# EAGLE design BRUTUS CONTROL BOARD (EAGLE 6.4)
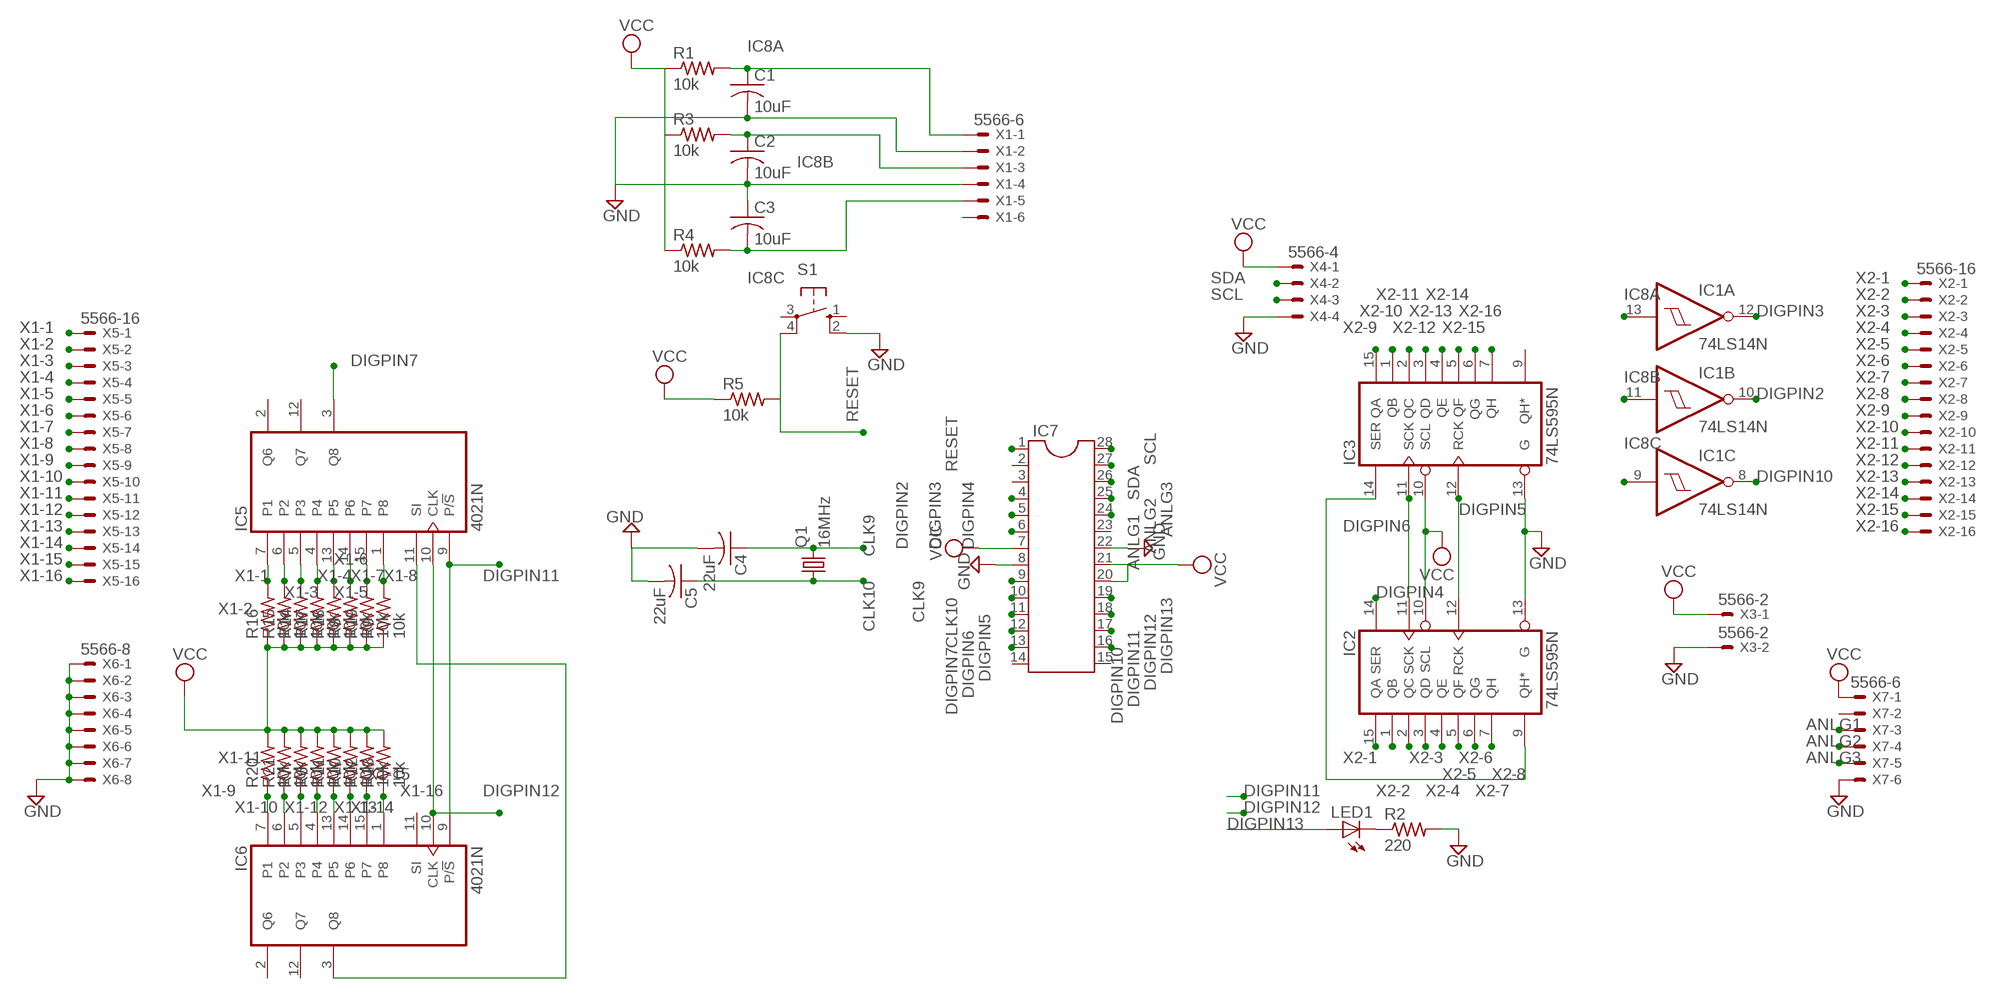
[diagram p0: schematic, sheet 1]

## Parts
C1  10uF  C-US025-025X050  [C025-025X050]
C2  10uF  C-US025-025X050  [C025-025X050]
C3  10uF  C-US025-025X050  [C025-025X050]
C4  22uF  C-US025-025X050  [C025-025X050]
C5  22uF  C-US025-025X050  [C025-025X050]
IC1  74LS14N  [DIL14]
IC2  74LS595N  [DIL16]
IC3  74LS595N  [DIL16]
IC5  4021N  [DIL16]
IC6  4021N  [DIL16]
IC7  DIL28-3  [DIL28-3]
LED1  LED5MM  [LED5MM]
Q1  16MHz  CRYSTALHC49S  [HC49/S]
R1  10k  R-US_0204/2V  [0204V]
R2  220  R-US_0204/2V  [0204V]
R3  10k  R-US_0204/2V  [0204V]
R4  10k  R-US_0204/2V  [0204V]
R5  10k  R-US_0204/2V  [0204V]
R6  10k  R-US_0204/2V  [0204V]
R7  10k  R-US_0204/2V  [0204V]
R8  10k  R-US_0204/2V  [0204V]
R9  10k  R-US_0204/2V  [0204V]
R10  10k  R-US_0204/2V  [0204V]
R11  10k  R-US_0204/2V  [0204V]
R12  10k  R-US_0204/2V  [0204V]
R13  10k  R-US_0204/2V  [0204V]
R14  10k  R-US_0204/2V  [0204V]
R15  10k  R-US_0204/2V  [0204V]
R16  10k  R-US_0204/2V  [0204V]
R17  10k  R-US_0204/2V  [0204V]
R18  10k  R-US_0204/2V  [0204V]
R19  10k  R-US_0204/2V  [0204V]
R20  10k  R-US_0204/2V  [0204V]
R21  10k  R-US_0204/2V  [0204V]
S1  40-XX  [B3F-40XX]
X1  5566-6  [5566-6]
X2  5566-16  [5566-16]
X3  5566-2  [5566-2]
X4  5566-4  [5566-4]
X5  5566-16  [5566-16]
X6  5566-8  [5566-8]
X7  5566-6  [5566-6]

## Nets
ANLG1: IC7.24 X7.3
ANLG2: IC7.25 X7.4
ANLG3: IC7.26 X7.5
CLK9: C4.1 IC7.9 Q1.2
CLK10: C5.1 IC7.10 Q1.1
DIGPIN2: IC1.10(B:O) IC7.4
DIGPIN3: IC1.12(A:O) IC7.5
DIGPIN4: IC2.14(SER) IC7.6
DIGPIN5: IC2.12(RCK) IC3.12(RCK) IC7.11
DIGPIN6: IC2.11(SCK) IC3.11(SCK) IC7.12
DIGPIN7: IC5.3(Q8) IC7.13
DIGPIN10: IC1.8(C:O) IC7.16
DIGPIN11: IC5.9(P/!S) IC6.9(P/!S) IC7.17
DIGPIN12: IC5.10(CLK) IC6.10(CLK) IC7.18
DIGPIN13: IC7.19 LED1.A
GND: C1.2 C2.2 C3.1 C4.2 C5.2 IC2.13(G) IC3.13(G) IC7.8 IC7.22 R2.2 S1.2(S1) X1.2 X1.4 X3.2 X4.4 X6.1 X6.2 X6.3 X6.4 X6.5 X6.6 X6.7 X6.8 X7.6
IC8A: C1.1 IC1.13(A:I) R1.2 X1.1
IC8B: C2.1 IC1.11(B:I) R3.2 X1.3
IC8C: C3.2 IC1.9(C:I) R4.2 X1.5
N$6: LED1.K(C) R2.1
N$7: IC2.9(QH*) IC3.14(SER)
N$17: IC5.11(SI) IC6.3(Q8)
RESET: IC7.1 R5.2 S1.4(P1)
SCL: IC7.28 X4.3
SDA: IC7.27 X4.2
VCC: IC3.10(SCL) IC7.7 IC7.20 IC7.21 R1.1 R4.1 R5.1 R6.2 R7.2 R8.1 R9.1 R10.2 R11.2 R12.2 R13.2 R14.1 R15.1 R16.1 R17.1 R18.1 R19.1 R20.2 R21.2 X3.1 X4.1 X7.1
X1-1: IC5.7(P1) R16.2 X5.1
X1-2: IC5.6(P2) R15.2 X5.2
X1-3: IC5.5(P3) R14.2 X5.3
X1-4: IC5.4 R17.2 X5.4
X1-5: IC5.13(P5) R18.2 X5.5
X1-6: IC5.14(P6) R8.2 X5.6
X1-7: IC5.15(P7) R19.2 X5.7
X1-8: IC5.1(P8) R9.2 X5.8
X1-9: IC6.7(P1) R20.1 X5.9
X1-10: IC6.6(P2) R21.1 X5.10
X1-11: IC6.5(P3) R7.1 X5.11
X1-12: IC6.4 R6.1 X5.12
X1-13: R11.1 X5.13
X1-14: IC6.14(P6) R10.1 X5.14
X1-15: IC6.15(P7) R12.1 X5.15
X1-16: IC6.1(P8) R13.1 X5.16
X2-1: IC2.15(QA) X2.1
X2-2: IC2.1(QB) X2.2
X2-3: IC2.2(QC) X2.3
X2-4: IC2.3(QD) X2.4
X2-5: IC2.4(QE) X2.5
X2-6: IC2.5(QF) X2.6
X2-7: IC2.6(QG) X2.7
X2-8: IC2.7(QH) X2.8
X2-9: IC3.15(QA) X2.9
X2-10: IC3.1(QB) X2.10
X2-11: IC3.2(QC) X2.11
X2-12: IC3.3(QD) X2.12
X2-13: IC3.4(QE) X2.13
X2-14: IC3.5(QF) X2.14
X2-15: IC3.6(QG) X2.15
X2-16: IC3.7(QH) X2.16
Unconnected: IC1.1(D:I) IC1.2(D:O) IC1.3(E:I) IC1.4(E:O) IC1.5(F:I) IC1.6(F:O) IC2.10(SCL) IC3.9(QH*) IC5.2(Q6) IC5.12(Q7) IC6.2(Q6) IC6.11(SI) IC6.12(Q7) IC6.13(P5) IC7.2 IC7.3 IC7.14 IC7.15 IC7.23 R3.1 S1.1(S) S1.3(P) X1.6 X7.2

## Power pins joined to a net without a drawn wire
GND: IC1.7(P:GND) IC2.8(GND) IC3.8(GND)
VCC: IC1.14(P:VCC) IC2.16(VCC) IC3.16(VCC)
VDD: IC5.16(VDD) IC6.16(VDD)
VSS: IC5.8(VSS) IC6.8(VSS)

## Library data of the parts
C1-C5 = adafruit:C-US: CAPACITOR, American symbol
IC1 = 74xx-us:74*14: Hex schmitt trigger INVERTER
IC2 IC3 = 74xx-us:74*595: 8-bit SHIFT REGISTER, output latch
IC5 IC6 = 40xx:4021: 8-bit static SHIFT REGISTER
IC7 = ic-package:DIL28: Dual In Line
LED1 = adafruit:LED: LED OSRAM: - CHIPLED LG R971, LG N971, LY N971, LG Q971, LY Q971, LO R971, LY R971 LH N974, LH R974 LS Q976, LO Q976, LY Q976 LO Q996 - Hyper CHIPLED LW Q18S LB Q993, LB Q99A, LB R99A - SideLED LS A670, LO A670, LY A670, LG A670, LP A670 LB A673, LV A673, LT A673, LW A673 LH A674 LY A675 LS A676, LA A676, LO A676, LY A676, LW A676 LS A679, LY A679, LG A679 - Hyper Micro SIDELED® LS Y876, LA Y876, LO Y876, LY Y876 LT Y87S - SmartLED LW L88C, LW L88S LB L89C, LB L89S, LG L890 LS L89K, LO L89K, LY L89K LS L896, LA L896, LO L896, LY L896 - TOPLED LS T670, LO T670, LY T670, LG T670, LP T670 LSG T670, LSP T670, LSY T670, LOP T670, LYG T670 LG T671, LOG T671, LSG T671 LB T673, LV T673, LT T673, LW T673 LH T674 LS T676, LA T676, LO T676, LY T676, LB T676, LH T676, LSB T676, LW T676 LB T67C, LV T67C, LT T67C, LS T67K, LO T67K, LY T67K, LW E67C LS E67B, LA E67B, LO E67B, LY E67B, LB E67C, LV E67C, LT E67C LW T67C LS T679, LY T679, LG T679 LS T770, LO T770, LY T770, LG T770, LP T770 LB T773, LV T773, LT T773, LW T773 LH T774 LS E675, LA E675, LY E675, LS T675 LS T776, LA T776, LO T776, LY T776, LB T776 LHGB T686 LT T68C, LB T68C - Hyper Mini TOPLED® LB M676 - Mini TOPLED Santana® LG M470 LS M47K, LO M47K, LY M47K Source: http://www.osram.convergy.de/
Q1 = adafruit:CRYSTAL: CRYSTAL; OC_FARNELL: 1667008; OC_NEWARK: unknown
R1-R21 = adafruit:R-US_: RESISTOR, American symbol
S1 = adafruit:40-XX: OMRON SWITCH; MF: OMRON COMPONENTS USA; MPN: B3F-4000; OC_FARNELL: 176434; OC_NEWARK: 36K3105
X1 X7 = con-molex:5566-6: Mini FIT connector 6 pol Source: http://www.molex.com; MPN: 95566-61002; OC_FARNELL: unknown; OC_NEWARK: 22K8620
X2 X5 = con-molex:5566-16: Mini FIT connector 16 pol Source: http://www.molex.com; OC_FARNELL: unknown; OC_NEWARK: unknown
X3 = con-molex:5566-2: Mini FIT connector 2 pol Source: http://www.molex.com; OC_FARNELL: 1822072; OC_NEWARK: unknown
X4 = con-molex:5566-4: Mini FIT connector 4 pol Source: http://www.molex.com; OC_FARNELL: unknown; OC_NEWARK: unknown
X6 = con-molex:5566-8: Mini FIT connector 8 pol Source: http://www.molex.com; OC_FARNELL: unknown; OC_NEWARK: unknown

## Net classes
0 default: width 0.381 mm, drill 0.001 mm, clearance 0.254 mm

## Board
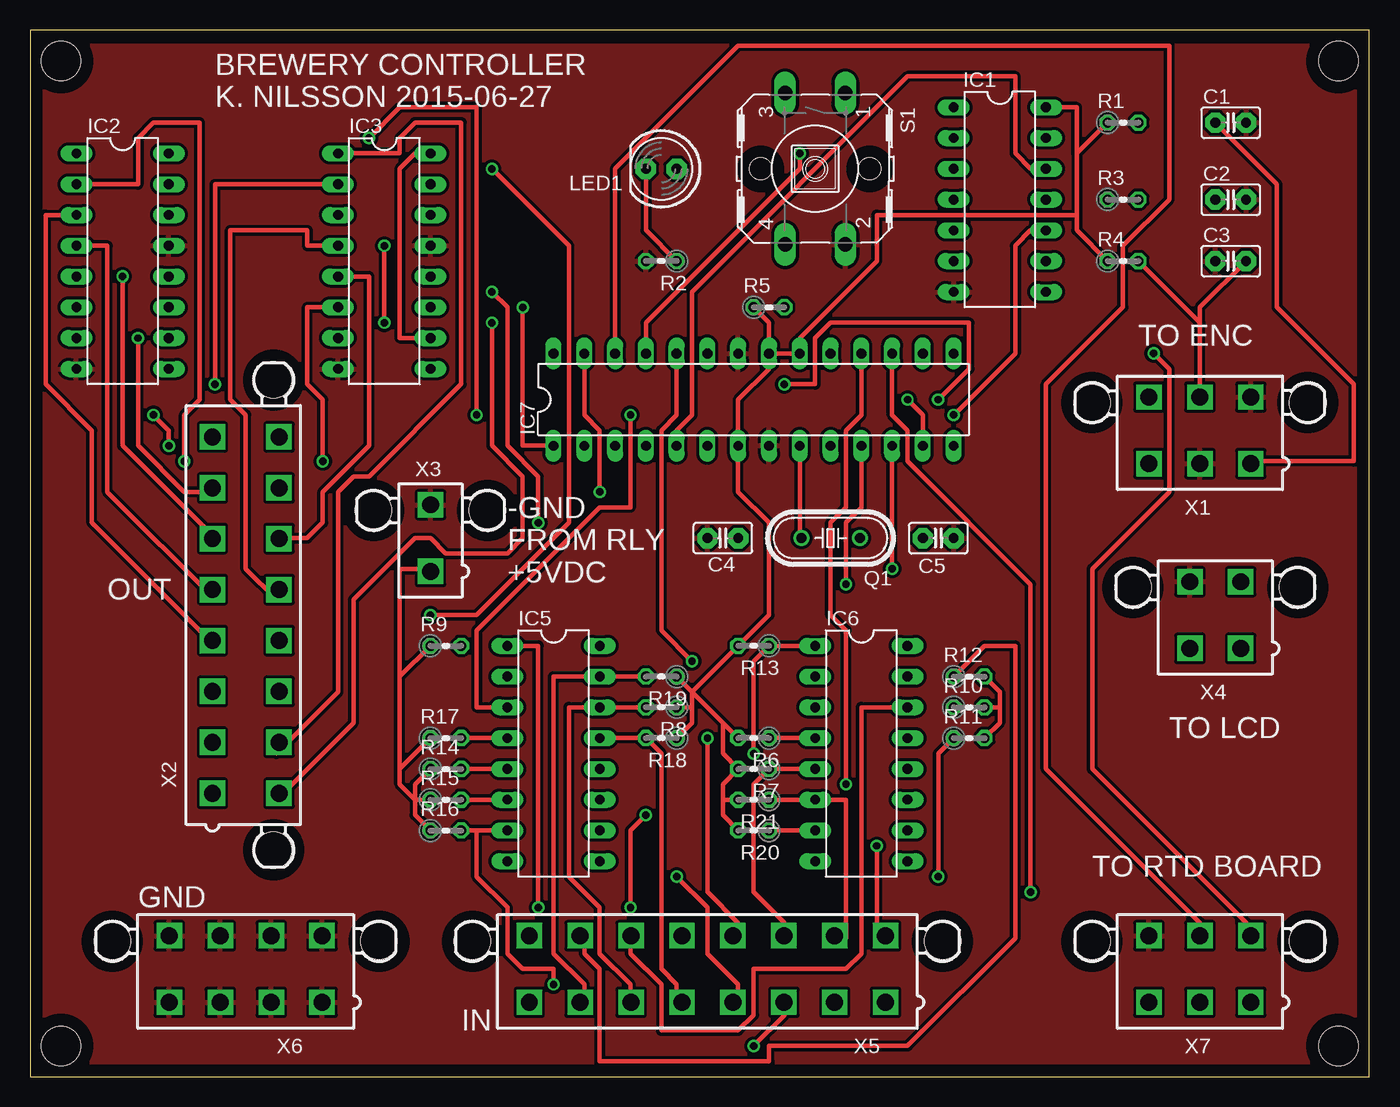
[diagram p1: board, top side]
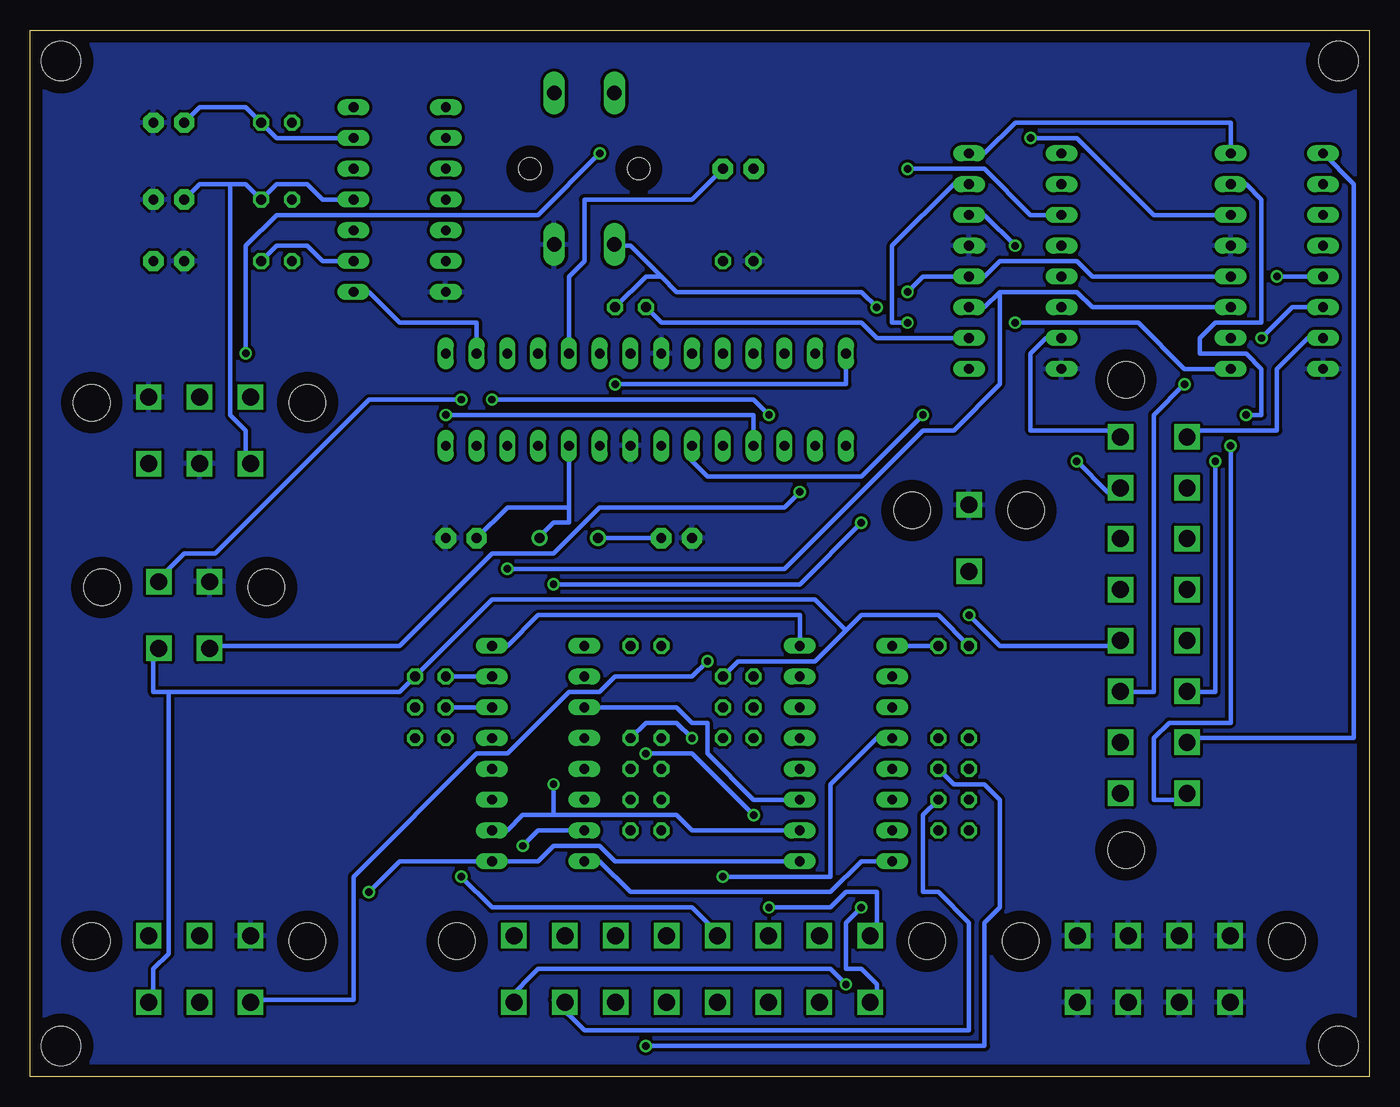
[diagram p2: board, bottom side, seen from below]

Size 110.49 x 86.36 mm. Coordinates in mm from the lower left corner, seen from the top.
Outline: 0,0 110.49,0 110.49,86.36 0,86.35 0,0
Copper layers (1*16): Top 0.035mm / dielectric 1.5mm / Bottom 0.035mm
Design rules "default": minimum track width 10mil, minimum drill 24mil, track to track 8mil, track to pad 8mil, pad to pad 8mil, via to via 8mil, smd to smd 8mil, copper to edge 40mil, drill to drill 8mil, minimum pad ring 10mil, minimum via ring 8mil, stop-mask expansion 4mil, vias tented up to drill 0mil, thermal gap 10mil
Holes 3.26 mm at 107.95,83.82 2.54,83.82 2.54,2.54 107.95,2.54

### Footprints (pad centres in the part's own frame; a part is rotated, then mirrored left to right if it is on the bottom)
C025-025X050 = drill 0.813 pad 1.676 octagon: 1 -1.27,0; 2 1.27,0
DIL14 = drill 0.813 long: 1 -7.62,-3.81; 2 -5.08,-3.81; 3 -2.54,-3.81; 4 0,-3.81; 5 2.54,-3.81; 6 5.08,-3.81; 7 7.62,-3.81; 8 7.62,3.81; 9 5.08,3.81; 10 2.54,3.81; 11 0,3.81; 12 -2.54,3.81; 13 -5.08,3.81; 14 -7.62,3.81
DIL16 = drill 0.813 long: 1 -8.89,-3.81; 2 -6.35,-3.81; 3 -3.81,-3.81; 4 -1.27,-3.81; 5 1.27,-3.81; 6 3.81,-3.81; 7 6.35,-3.81; 8 8.89,-3.81; 9 8.89,3.81; 10 6.35,3.81; 11 3.81,3.81; 12 1.27,3.81; 13 -1.27,3.81; 14 -3.81,3.81; 15 -6.35,3.81; 16 -8.89,3.81
DIL28-3 = drill 0.813 long: 1 -16.51,-3.81; 2 -13.97,-3.81; 3 -11.43,-3.81; 4 -8.89,-3.81; 5 -6.35,-3.81; 6 -3.81,-3.81; 7 -1.27,-3.81; 8 1.27,-3.81; 9 3.81,-3.81; 10 6.35,-3.81; 11 8.89,-3.81; 12 11.43,-3.81; 13 13.97,-3.81; 14 16.51,-3.81; 15 16.51,3.81; 16 13.97,3.81; 17 11.43,3.81; 18 8.89,3.81; 19 6.35,3.81; 20 3.81,3.81; 21 1.27,3.81; 22 -1.27,3.81; 23 -3.81,3.81; 24 -6.35,3.81; 25 -8.89,3.81; 26 -11.43,3.81; 27 -13.97,3.81; 28 -16.51,3.81
LED5MM = drill 0.813 pad 1.676 octagon: A -1.27,0; K 1.27,0
HC49/S = drill 0.813: 1 -2.413,0; 2 2.413,0
0204V = drill 0.813 octagon: 1 -1.27,0; 2 1.27,0
B3F-40XX = drill 1.194 long: 1 -6.248,2.489; 2 6.248,2.489; 3 -6.248,-2.489; 4 6.248,-2.489 | hole 1.803: 0,-4.496; 0,4.496
5566-6 = drill 1.4 square: 1 4.2,-2.75; 2 0,-2.75; 3 -4.2,-2.75; 4 4.2,2.75; 5 0,2.75; 6 -4.2,2.75 | hole 3: 8.9,2.29; -8.9,2.29
5566-16 = drill 1.4 square: 1 14.7,-2.75; 2 10.5,-2.75; 3 6.3,-2.75; 4 2.1,-2.75; 5 -2.1,-2.75; 6 -6.3,-2.75; 7 -10.5,-2.75; 8 -14.7,-2.75; 9 14.7,2.75; 10 10.5,2.75; 11 6.3,2.75; 12 2.1,2.75; 13 -2.1,2.75; 14 -6.3,2.75; 15 -10.5,2.75; 16 -14.7,2.75 | hole 3: 19.4,2.29; -19.4,2.29
5566-2 = drill 1.4 square: 1 0,-2.75; 2 0,2.75 | hole 3: 4.7,2.29; -4.7,2.29
5566-4 = drill 1.4 square: 1 2.1,-2.75; 2 -2.1,-2.75; 3 2.1,2.75; 4 -2.1,2.75 | hole 3: 6.8,2.29; -6.8,2.29
5566-8 = drill 1.4 square: 1 6.3,-2.75; 2 2.1,-2.75; 3 -2.1,-2.75; 4 -6.3,-2.75; 5 6.3,2.75; 6 2.1,2.75; 7 -2.1,2.75; 8 -6.3,2.75 | hole 3: 11,2.29; -11,2.29

### Placement (x,y rotation side)
C1  99.06,78.74 0 top
C2  99.06,72.39 0 top
C3  99.06,67.31 0 top
C4  57.15,44.45 180 top
C5  74.93,44.45 0 top
IC1  80.01,72.39 270 top
IC2  7.62,67.31 270 top
IC3  29.21,67.31 270 top
IC5  43.18,26.67 270 top
IC6  68.58,26.67 270 top
IC7  59.69,55.88 0 top
LED1  52.07,74.93 180 top
Q1  66.04,44.45 180 top
R1  90.17,78.74 0 top
R2  52.07,67.31 180 top
R3  90.17,72.39 0 top
R4  90.17,67.31 0 top
R5  60.96,63.5 0 top
R6  59.69,27.94 180 top
R7  59.69,25.4 180 top
R8  52.07,30.48 180 top
R9  34.29,35.56 0 top
R10  77.47,30.48 0 top
R11  77.47,27.94 0 top
R12  77.47,33.02 0 top
R13  59.69,35.56 180 top
R14  34.29,25.4 0 top
R15  34.29,22.86 0 top
R16  34.29,20.32 0 top
R17  34.29,27.94 0 top
R18  52.07,27.94 180 top
R19  52.07,33.02 180 top
R20  59.69,20.32 180 top
R21  59.69,22.86 180 top
S1  64.77,74.93 270 top
X1  96.52,53.34 0 top
X2  17.78,38.1 270 top
X3  33.02,44.45 0 top
X4  97.79,38.1 0 top
X5  55.88,8.89 0 top
X6  17.78,8.89 0 top
X7  96.52,8.89 0 top

### Tracks (layer width: path | path; a pad name or v marks a point on that pad's centre or on a via)
ANLG1  (via drill 0.61)
  Top 0.381: IC7.24 53.34,54.61 52.07,53.34 52.07,36.83 v54.61,34.29
  Bottom 0.381: v54.61,34.29 55.88,33.02 62.23,33.02 63.5,31.75 66.04,31.75 71.12,26.67 73.66,26.67 83.82,16.51 83.82,6.35 91.44,6.35 X7.3
ANLG2  (via drill 0.61)
  Top 0.381: IC7.25 50.8,62.23 63.5,74.93 v63.5,76.2 | v92.71,59.69 93.98,58.42 93.98,48.26 87.63,41.91 87.63,25.4 100.33,12.7 100.33,11.43 X7.4
  Bottom 0.381: v63.5,76.2 68.58,71.12 90.17,71.12 92.71,68.58 v92.71,59.69
ANLG3
  Top 0.381: IC7.26 48.26,74.93 58.42,85.09 93.98,85.09 93.98,72.39 90.17,68.58 90.17,63.5 83.82,57.15 83.82,25.4 96.52,12.7 X7.5 96.52,11.43
CLK9
  Top 0.381: IC7.9 63.5,44.45 Q1.2
  Bottom 0.381: C4.1 Q1.2
CLK10
  Bottom 0.381: 66.04,46.99 66.04,45.72 67.31,45.72 68.58,44.45 Q1.1 | 66.04,46.99 IC7.10 | C5.1 71.12,46.99 66.04,46.99
DIGPIN2  (via drill 0.61)
  Top 0.381: v76.2,54.61 81.28,59.69 81.28,68.58 82.55,69.85 IC1.10
  Bottom 0.381: IC7.4 50.8,54.61 v76.2,54.61
DIGPIN3
  Top 0.381: IC7.5 53.34,53.34 54.61,54.61 54.61,64.77 72.39,82.55 81.28,82.55 81.28,76.2 82.55,74.93 IC1.12
DIGPIN4  (via drill 0.61)
  Top 0.381: v27.94,77.47 30.48,80.01 36.83,80.01 v36.83,54.61
  Bottom 0.381: IC2.14 17.78,71.12 24.13,77.47 v27.94,77.47 | v36.83,54.61 41.91,49.53 54.61,49.53 55.88,50.8 IC7.6
DIGPIN5  (via drill 0.61)
  Top 0.381: IC7.11 68.58,46.99 67.31,45.72 v67.31,40.64 | v41.91,45.72 41.91,49.53 39.37,52.07 39.37,63.5 v38.1,64.77
  Bottom 0.381: IC2.12 22.86,66.04 24.13,67.31 30.48,67.31 31.75,66.04 IC3.12 36.83,66.04 v38.1,64.77 | v67.31,40.64 46.99,40.64 v41.91,45.72
DIGPIN6  (via drill 0.61)
  Top 0.381: v71.12,41.91 IC7.12
  Bottom 0.381: IC2.11 22.86,63.5 24.13,64.77 30.48,64.77 | 30.48,64.77 31.75,63.5 IC3.11 | v71.12,41.91 48.26,41.91 36.83,53.34 34.29,53.34 30.48,57.15 30.48,64.77
DIGPIN7  (via drill 0.61)
  Top 0.381: IC5.3 36.83,30.48 36.83,36.83 46.99,46.99 49.53,46.99 v49.53,54.61 | v72.39,55.88 73.66,54.61 IC7.13
  Bottom 0.381: v49.53,54.61 50.8,55.88 v72.39,55.88
DIGPIN10
  Bottom 0.381: IC7.16 73.66,62.23 80.01,62.23 82.55,64.77 IC1.8
DIGPIN11  (via drill 0.61)
  Top 0.381: IC7.17 71.12,54.61 72.39,53.34 72.39,50.8 82.55,40.64 v82.55,15.24
  Bottom 0.381: IC5.9 62.23,17.78 63.5,19.05 67.31,19.05 68.58,17.78 IC6.9 80.01,17.78 v82.55,15.24
DIGPIN12  (via drill 0.61)
  Top 0.381: IC7.18 68.58,54.61 67.31,53.34 67.31,46.99 66.04,45.72 66.04,38.1 67.31,36.83 v67.31,24.13
  Bottom 0.381: IC5.10 55.88,20.32 57.15,21.59 67.31,21.59 | 67.31,21.59 69.85,21.59 71.12,20.32 IC6.10 | 67.31,21.59 v67.31,24.13
DIGPIN13
  Bottom 0.381: IC7.19 66.04,66.04 64.77,67.31 64.77,72.39 55.88,72.39 LED1.A
GND
  pour Top: -2.54,-1.27 -2.54,85.09 128.27,85.09 128.27,-1.27
  pour Bottom: -1.27,87.63 -1.27,-1.27 113.03,-1.27 113.03,87.63
IC8A
  Top 0.381: C1.1 102.87,73.66 102.87,63.5 109.22,57.15 109.22,50.8 101.6,50.8 X1.1
  Bottom 0.381: IC1.13 90.17,77.47 R1.2 92.71,80.01 96.52,80.01 C1.1
IC8B
  Bottom 0.381: IC1.11 86.36,72.39 87.63,73.66 90.17,73.66 R3.2 92.71,73.66 93.98,73.66 | C2.1 96.52,73.66 93.98,73.66 | 93.98,73.66 93.98,54.61 92.71,53.34 92.71,50.8 X1.3
IC8C
  Top 0.381: C3.2 96.52,63.5 96.52,62.23 | 96.52,62.23 X1.5 96.52,55.88 | 96.52,62.23 R4.2
  Bottom 0.381: IC1.9 86.36,67.31 87.63,68.58 90.17,68.58 R4.2
N$6
  Top 0.381: R2.1 50.8,69.85 LED1.K
N$7  (via drill 0.61)
  Top 0.381: v29.21,68.58 v29.21,62.23
  Bottom 0.381: IC2.9 15.24,58.42 19.05,62.23 v29.21,62.23 | v29.21,68.58 31.75,71.12 IC3.14
N$17
  Bottom 0.381: IC5.11 50.8,22.86 54.61,26.67 54.61,29.21 55.88,29.21 57.15,30.48 IC6.3
RESET  (via drill 0.61)
  Top 0.381: IC7.1 40.64,52.07 v40.64,63.5
  Bottom 0.381: v40.64,63.5 41.91,64.77 57.15,64.77 58.42,66.04 | 58.42,66.04 60.96,68.58 62.23,68.58 S1.4 | R5.2 59.69,66.04 58.42,66.04
SCL  (via drill 0.61)
  Top 0.381: v62.23,57.15 64.77,57.15 64.77,60.96 66.04,62.23 77.47,62.23 77.47,58.42 v74.93,55.88
  Bottom 0.381: IC7.28 43.18,57.15 v62.23,57.15 | v74.93,55.88 82.55,55.88 95.25,43.18 97.79,43.18 100.33,40.64 X4.3
SDA  (via drill 0.61)
  Top 0.381: IC7.27 45.72,54.61 46.99,53.34 v46.99,48.26
  Bottom 0.381: v46.99,48.26 48.26,46.99 63.5,46.99 67.31,43.18 72.39,43.18 80.01,35.56 95.25,35.56 X4.2
VCC
  Top 0.381: R11.2 80.01,29.21 80.01,30.48 | 80.01,30.48 80.01,31.75 R12.2 | 80.01,30.48 R10.2 | IC3.10 30.48,60.96 30.48,74.93 31.75,76.2 IC3.16 | R16.1 31.75,21.59 31.75,22.86 | 31.75,22.86 31.75,24.13 R14.1 | 31.75,22.86 R15.1 | 30.48,25.4 R17.1 | 30.48,25.4 30.48,24.13 31.75,22.86 | 30.48,33.02 R9.1 | 30.48,25.4 30.48,33.02 | 30.48,33.02 30.48,41.91 33.02,41.91 X3.1 | R4.1 86.36,69.85 86.36,71.12 | 86.36,76.2 86.36,71.12 | R1.1 86.36,76.2 | IC1.14 86.36,80.01 86.36,76.2 | IC7.21 60.96,58.42 58.42,55.88 IC7.7 58.42,48.26 60.96,45.72 60.96,38.1 R13.2 54.61,31.75 | IC7.21 IC7.20 63.5,60.96 69.85,67.31 69.85,71.12 86.36,71.12 | R5.1 60.96,62.23 IC7.21 | R20.2 57.15,21.59 57.15,22.86 | 57.15,22.86 57.15,24.13 R7.2 57.15,26.67 57.15,29.21 | 57.15,22.86 R21.2 | R18.1 54.61,29.21 54.61,30.48 | 54.61,31.75 54.61,30.48 | R19.1 54.61,31.75 | 54.61,30.48 R8.1 | 54.61,31.75 57.15,29.21 | 57.15,29.21 R6.2
  Bottom 0.381: 99.06,31.75 80.01,31.75 R12.2 72.39,39.37 45.72,39.37 43.18,36.83 | 99.06,31.75 100.33,31.75 100.33,35.56 X4.1 | 99.06,31.75 99.06,10.16 100.33,8.89 100.33,6.35 X7.1 | IC2.16 11.43,78.74 29.21,78.74 31.75,76.2 IC3.16 | R9.1 35.56,38.1 41.91,38.1 43.18,36.83 | 43.18,36.83 45.72,34.29 52.07,34.29 R19.1 | IC3.10 40.64,60.96 41.91,62.23 58.42,62.23 R5.1
VDD
  Bottom 0.381: IC5.16 46.99,38.1 68.58,38.1 71.12,35.56 IC6.16
VSS
  Bottom 0.381: IC5.8 41.91,17.78 44.45,15.24 60.96,15.24 63.5,17.78 IC6.8
X1-1  (via drill 0.61)
  Top 0.381: IC5.7 36.83,20.32 | 36.83,20.32 R16.2 | 36.83,20.32 36.83,16.51 39.37,13.97 39.37,10.16 40.64,8.89 43.18,8.89 v43.18,7.62
  Bottom 0.381: v43.18,7.62 44.45,8.89 68.58,8.89 71.12,6.35 X5.1
X1-2
  Top 0.381: IC5.6 R15.2
  Bottom 0.381: R15.2 36.83,21.59 36.83,15.24 35.56,15.24 33.02,12.7 33.02,3.81 64.77,3.81 67.31,6.35 X5.2
X1-3  (via drill 0.61)
  Top 0.381: IC5.5 R14.2 | v59.69,2.54 62.23,5.08 62.23,6.35 X5.3
  Bottom 0.381: R14.2 34.29,24.13 31.75,24.13 30.48,22.86 30.48,13.97 31.75,12.7 31.75,2.54 v59.69,2.54
X1-4  (via drill 0.61)
  Top 0.381: IC5.4 R17.2 | v53.34,16.51 55.88,13.97 55.88,10.16 58.42,7.62 58.42,6.35 X5.4
  Bottom 0.381: IC5.4 40.64,27.94 44.45,24.13 44.45,16.51 v53.34,16.51
X1-5
  Top 0.381: IC5.13 R18.2 52.07,26.67 52.07,8.89 53.34,7.62 53.34,6.35 X5.5
X1-6
  Top 0.381: R8.2 IC5.14 44.45,30.48 44.45,16.51 46.99,13.97 46.99,10.16 49.53,7.62 49.53,6.35 X5.6
X1-7
  Top 0.381: R19.2 IC5.15 43.18,33.02 43.18,10.16 45.72,7.62 45.72,6.35 X5.7
X1-8  (via drill 0.61)
  Top 0.381: IC5.1 41.91,35.56 v41.91,13.97
  Bottom 0.381: IC5.1 R9.2 | v41.91,13.97 43.18,12.7 43.18,8.89 41.91,8.89 40.64,7.62 40.64,6.35 X5.8
X1-9  (via drill 0.61)
  Top 0.381: IC6.7 R20.1 | v69.85,19.05 69.85,11.43 X5.9
  Bottom 0.381: IC6.7 68.58,20.32 v69.85,19.05
X1-10
  Top 0.381: R21.1 IC6.6 67.31,22.86 67.31,11.43 X5.10
X1-11
  Top 0.381: IC6.5 R7.1 59.69,24.13 59.69,15.24 62.23,12.7 62.23,11.43 X5.11
X1-12  (via drill 0.61)
  Top 0.381: IC6.4 R6.1 | v55.88,27.94 55.88,15.24 58.42,12.7 58.42,11.43 X5.12
  Bottom 0.381: R6.1 59.69,29.21 57.15,29.21 v55.88,27.94
X1-13  (via drill 0.61)
  Top 0.381: R11.1 74.93,26.67 v74.93,16.51
  Bottom 0.381: v74.93,16.51 72.39,13.97 55.88,13.97 53.34,11.43 X5.13
X1-14
  Top 0.381: IC6.14 68.58,30.48 68.58,10.16 67.31,8.89 59.69,8.89 59.69,5.08 58.42,3.81 52.07,3.81 52.07,7.62 49.53,10.16 49.53,11.43 X5.14
  Bottom 0.381: R10.1 IC6.14
X1-15
  Top 0.381: R12.1 78.74,35.56 81.28,35.56 81.28,11.43 72.39,2.54 60.96,2.54 60.96,1.27 46.99,1.27 46.99,8.89 45.72,10.16 45.72,11.43 X5.15
  Bottom 0.381: R12.1 IC6.15
X1-16  (via drill 0.61)
  Top 0.381: IC6.1 R13.1 59.69,34.29 v59.69,26.67 | v50.8,21.59 49.53,20.32 v49.53,13.97
  Bottom 0.381: v59.69,26.67 55.88,26.67 v50.8,21.59 | v49.53,13.97 44.45,13.97 43.18,15.24 40.64,15.24 40.64,11.43 X5.16
X2-1  (via drill 0.61)
  Top 0.381: v10.16,54.61 11.43,53.34 v11.43,52.07
  Bottom 0.381: IC2.15 10.16,73.66 8.89,72.39 8.89,62.23 12.7,62.23 13.97,60.96 13.97,59.69 10.16,59.69 8.89,58.42 8.89,54.61 v10.16,54.61 | v11.43,52.07 11.43,29.21 16.51,29.21 17.78,27.94 17.78,22.86 15.24,22.86 X2.1
X2-2
  Bottom 0.381: IC2.1 1.27,73.66 1.27,27.94 15.24,27.94 X2.2
X2-3  (via drill 0.61)
  Top 0.381: IC2.2 8.89,73.66 8.89,77.47 10.16,78.74 13.97,78.74 13.97,55.88 12.7,54.61 v12.7,50.8
  Bottom 0.381: v12.7,50.8 12.7,31.75 15.24,31.75 X2.3
X2-4
  Top 0.381: IC2.3 1.27,71.12 1.27,57.15 5.08,53.34 5.08,45.72 15.24,35.56 X2.4
X2-5
  Top 0.381: IC2.4 6.35,68.58 6.35,48.26 15.24,39.37 X2.5
X2-6  (via drill 0.61)
  Top 0.381: v7.62,66.04 7.62,52.07 15.24,44.45 X2.6
  Bottom 0.381: v7.62,66.04 IC2.5
X2-7  (via drill 0.61)
  Top 0.381: v8.89,60.96 8.89,52.07 12.7,48.26 15.24,48.26 X2.7
  Bottom 0.381: IC2.6 6.35,63.5 v8.89,60.96
X2-8
  Bottom 0.381: IC2.7 5.08,60.96 7.62,58.42 7.62,53.34 15.24,53.34 X2.8
X2-9  (via drill 0.61)
  Top 0.381: v38.1,62.23 38.1,52.07 40.64,49.53 40.64,44.45 39.37,43.18 34.29,43.18 33.02,44.45 31.75,44.45 26.67,39.37 26.67,29.21 20.32,22.86 X2.9
  Bottom 0.381: IC3.15 34.29,73.66 39.37,68.58 39.37,62.23 v38.1,62.23
X2-10
  Top 0.381: IC3.1 30.48,76.2 30.48,77.47 31.75,78.74 35.56,78.74 35.56,57.15 27.94,49.53 26.67,49.53 25.4,48.26 25.4,31.75 20.32,26.67 X2.10
X2-11  (via drill 0.61)
  Top 0.381: IC3.2 15.24,73.66 v15.24,57.15
  Bottom 0.381: v15.24,57.15 17.78,54.61 17.78,31.75 20.32,31.75 X2.11
X2-12  (via drill 0.61)
  Top 0.381: v38.1,74.93 44.45,68.58 44.45,45.72 36.83,38.1 v33.02,38.1
  Bottom 0.381: IC3.3 27.94,71.12 31.75,74.93 v38.1,74.93 | v33.02,38.1 30.48,35.56 20.32,35.56 X2.12
X2-13
  Top 0.381: IC3.4 22.86,68.58 22.86,69.85 16.51,69.85 16.51,55.88 17.78,54.61 17.78,41.91 20.32,39.37 X2.13
X2-14
  Top 0.381: IC3.5 27.94,66.04 27.94,52.07 24.13,48.26 24.13,45.72 22.86,44.45 20.32,44.45 X2.14
X2-15  (via drill 0.61)
  Top 0.381: IC3.6 22.86,63.5 22.86,57.15 24.13,55.88 v24.13,50.8
  Bottom 0.381: v24.13,50.8 21.59,48.26 20.32,48.26 X2.15
X2-16
  Bottom 0.381: IC3.7 26.67,60.96 27.94,59.69 27.94,53.34 20.32,53.34 X2.16

### Text on the board
tSilk: BREWERY CONTROLLER / K. NILSSON 2015-06-27 | TO ENC | OUT | -GND / FROM RLY / +5VDC | TO LCD | TO RTD BOARD | GND | IN